# EAGLE board Hive_Max_Masse_neu4a (EAGLE 6.3), part 1 of 3
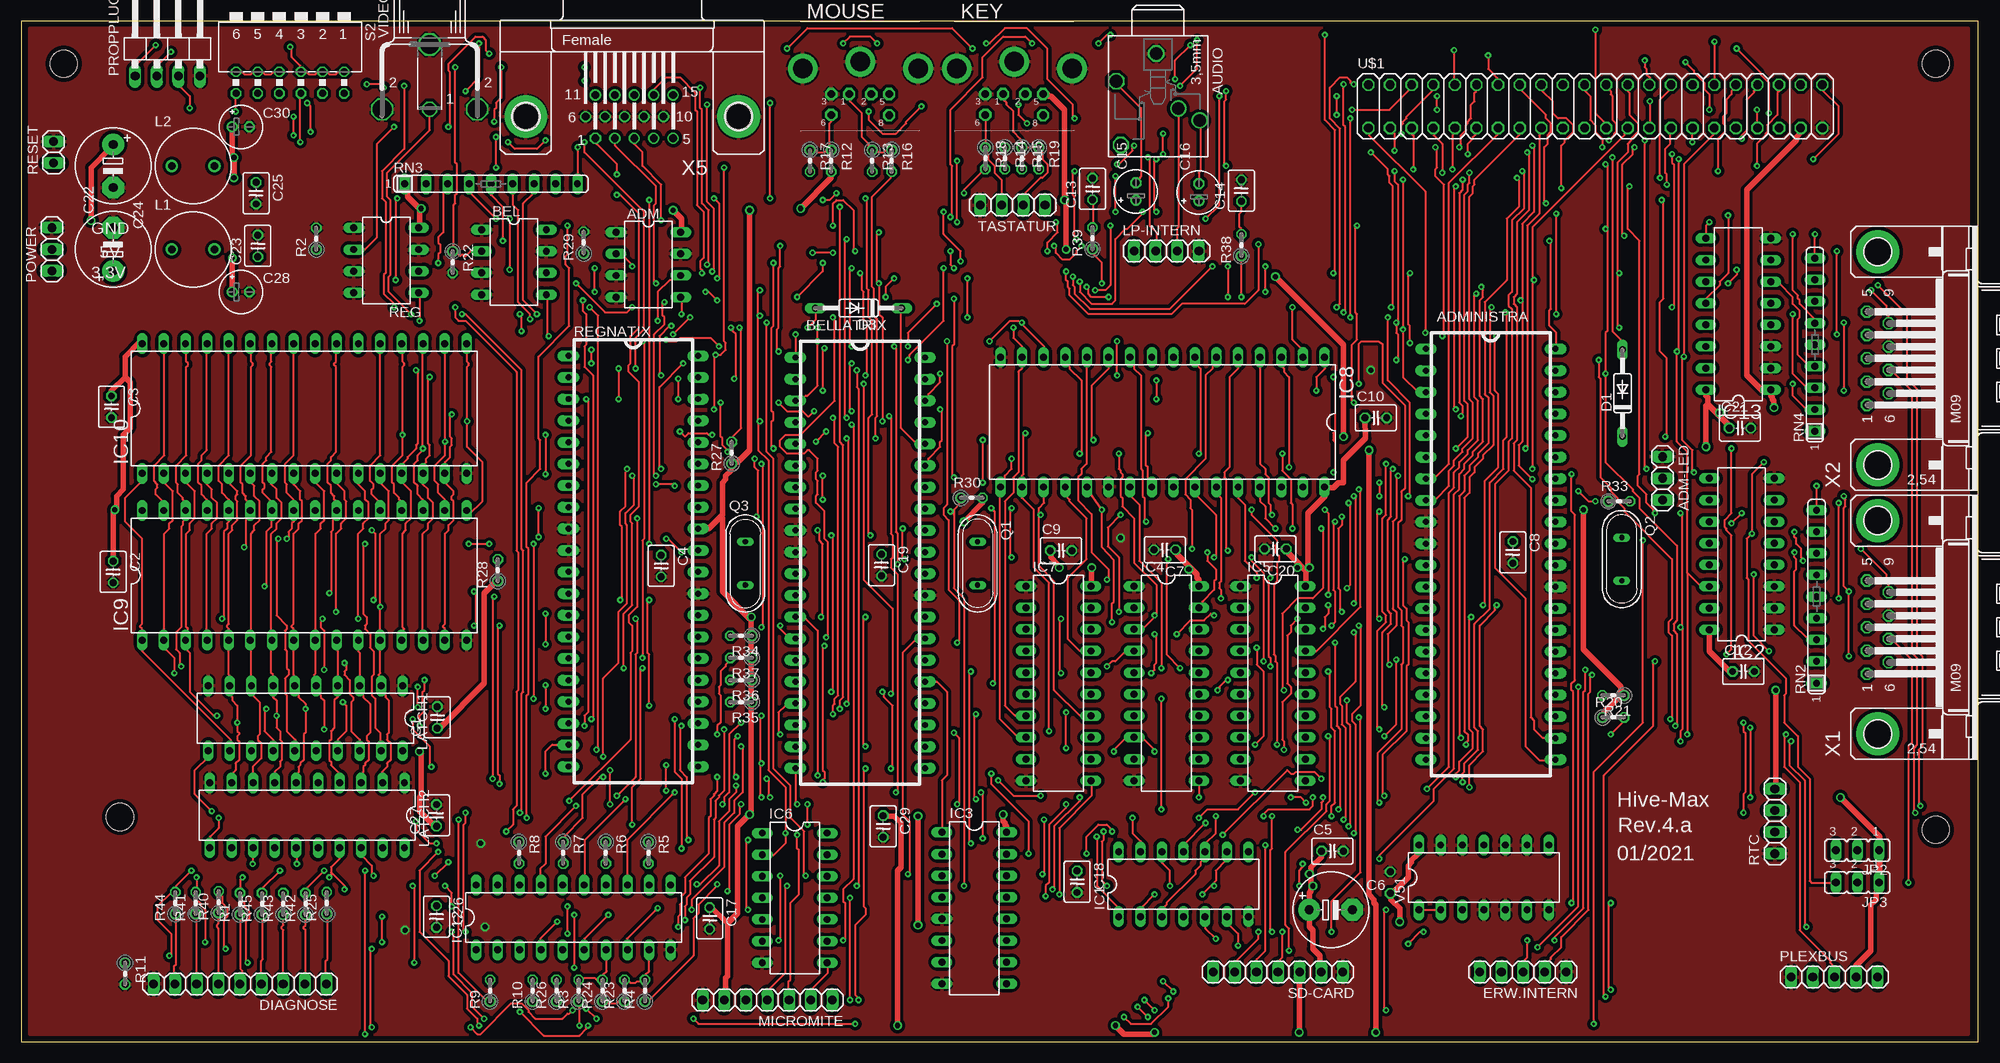
[diagram p5: board, top side]
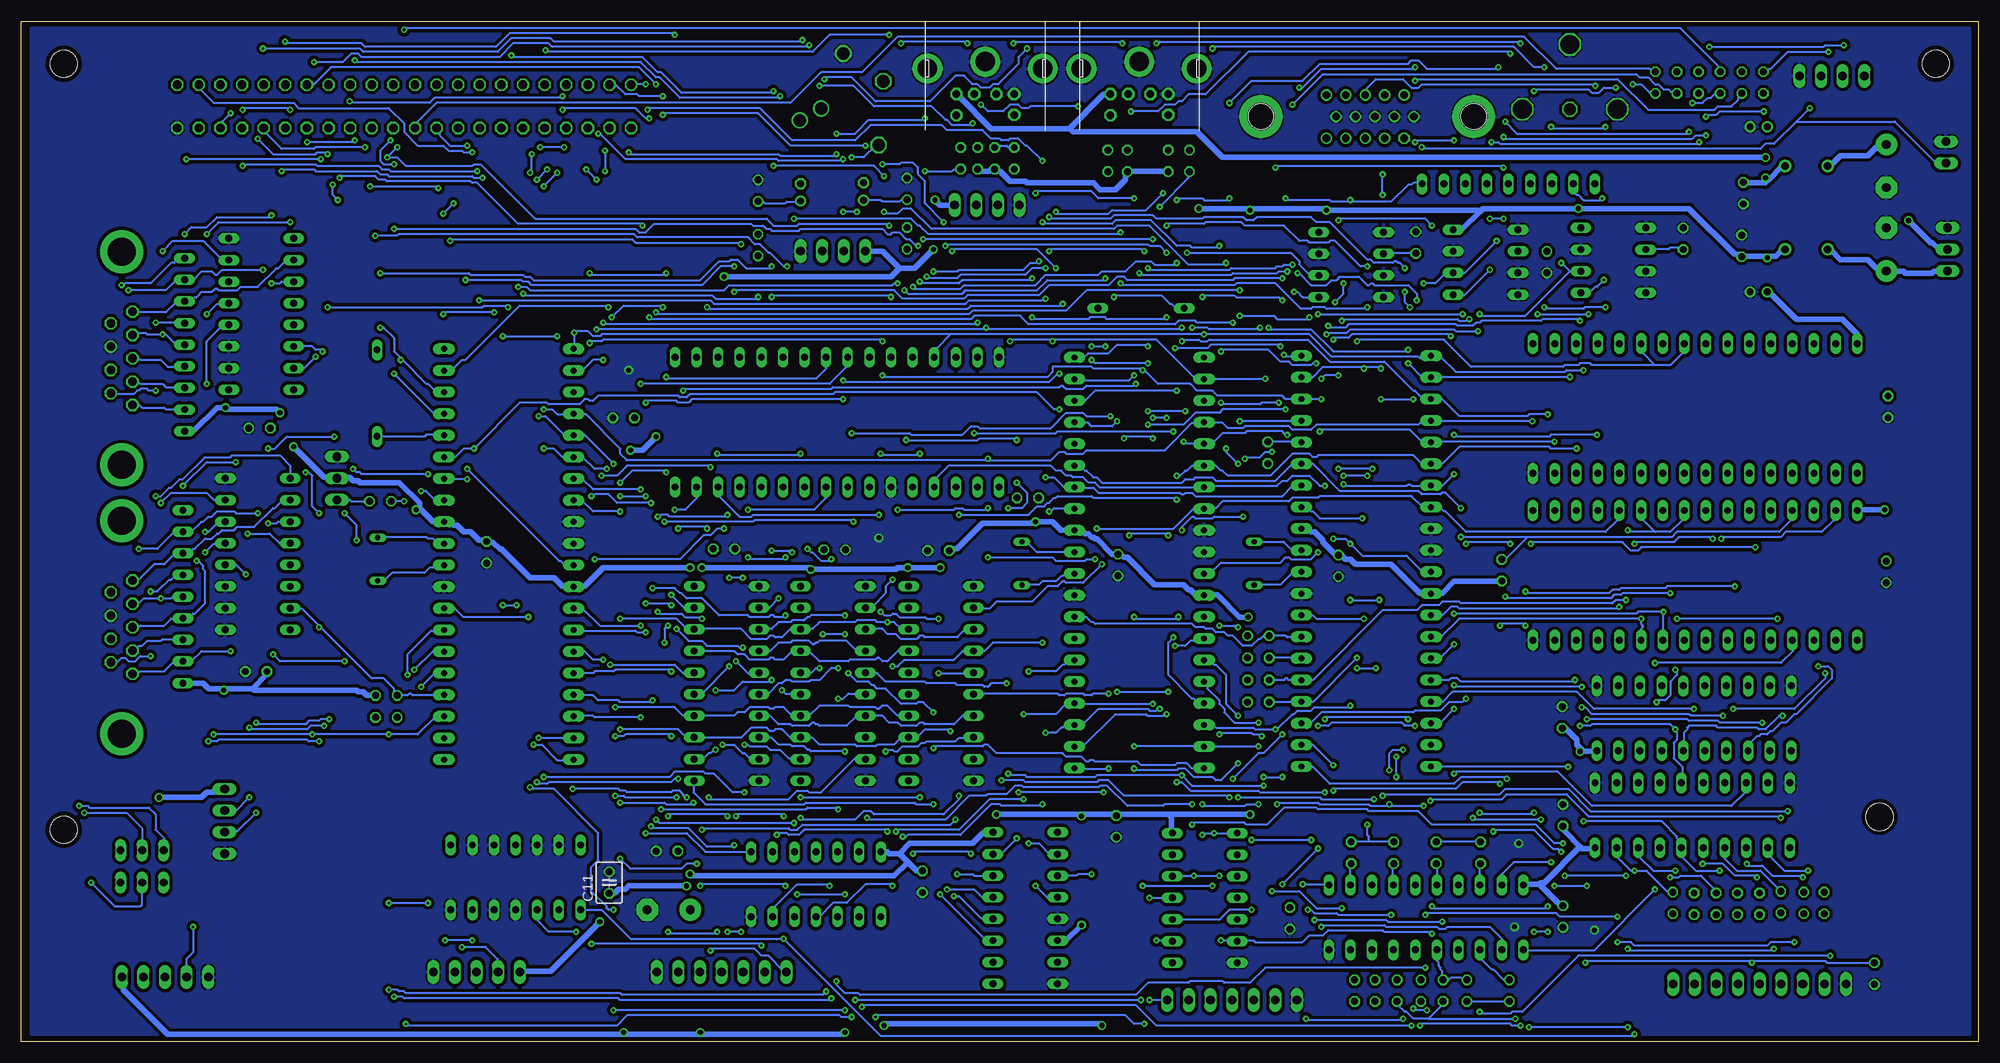
[diagram p6: board, bottom side, seen from below]

Size 230 x 119.9 mm. Coordinates in mm from the lower left corner, seen from the top.
Outline: 0,0 230,0 230,119.9 0,119.9 0,0
Copper layers (1*16): Top 0.035mm / dielectric 1.5mm / Bottom 0.035mm
Design rules "PCB-POOL": minimum track width 6mil, minimum drill 12mil, track to track 6mil, track to pad 6mil, pad to pad 6mil, via to via 6mil, smd to smd 6mil, copper to edge 20mil, drill to drill 8mil, minimum pad ring 8mil, minimum via ring 8mil, stop-mask expansion 3mil, vias tented up to drill 24mil, thermal gap 8mil
Net classes: 0 default: width 0.254 mm, clearance 0.254 mm; 1 Power: width 0.635 mm, drill 0.61 mm, clearance 0.381 mm; 2 AudioVideo: width 0.254 mm, clearance 0.254 mm; 3 Priority: width 0.279 mm, clearance 0.279 mm
Holes 3.2 mm at 5,114.9 11.6,26.4 225,24.9 225,114.9

## Footprints (pad centres in the part's own frame; a part is rotated, then mirrored left to right if it is on the bottom)
DIL08 = drill 0.813 long: 1 -3.81,-3.81; 2 -1.27,-3.81; 3 1.27,-3.81; 4 3.81,-3.81; 5 3.81,3.81; 6 1.27,3.81; 7 -1.27,3.81; 8 -3.81,3.81
1X03 = drill 1.016 long: 1 -2.54,0; 2 0,0; 3 2.54,0
P8X32A-D40 = drill 0.7 pad 1.27 long: 1 -7.62,23.495; 2 -7.62,20.955; 3 -7.62,18.415; 4 -7.62,15.875; 5 -7.62,13.335; 6 -7.62,10.795; 7 -7.62,8.255; 8 -7.62,5.715; 9 -7.62,3.175; 10 -7.62,0.635; 11 -7.62,-1.905; 12 -7.62,-4.445; 13 -7.62,-6.985; 14 -7.62,-9.525; 15 -7.62,-12.065; 16 -7.62,-14.605; 17 -7.62,-17.145; 18 -7.62,-19.685; 19 -7.62,-22.225; 20 -7.62,-24.765; 21 7.62,-24.765; 22 7.62,-22.225; 23 7.62,-19.685; 24 7.62,-17.145; 25 7.62,-14.605; 26 7.62,-12.065; 27 7.62,-9.525; 28 7.62,-6.985; 29 7.62,-4.445; 30 7.62,-1.905; 31 7.62,0.635; 32 7.62,3.175; 33 7.62,5.715; 34 7.62,8.255; 35 7.62,10.795; 36 7.62,13.335; 37 7.62,15.875; 38 7.62,18.415; 39 7.62,20.955; 40 7.62,23.495
PG203J = drill 1.499 octagon: 1 -5.004,-0.203; 4 5.74,-4.369; 5 -1.753,-4.902 | drill 1.499: 2 2.845,4.902; 3 1.448,2.388
C025-030X050 = drill 0.813 octagon: 1 -1.27,0; 2 1.27,0
E5-8,5 = drill 1.016 pad 2.54: + -2.54,0 | drill 1.016 pad 2.54 octagon: - 2.54,0
E2-5 = drill 0.813 pad 1.27: + -1.016,0 | drill 0.813 pad 1.27 octagon: - 1.016,0
DO35-10 = drill 0.813 long: A 5.08,0; C -5.08,0
1X09 = drill 1.016 long: 1 -10.16,0; 2 -7.62,0; 3 -5.08,0; 4 -2.54,0; 5 0,0; 6 2.54,0; 7 5.08,0; 8 7.62,0; 9 10.16,0
1X05 = drill 1.016 long: 1 -5.08,0; 2 -2.54,0; 3 0,0; 4 2.54,0; 5 5.08,0
DIL14 = drill 0.813 long: 1 -7.62,-3.81; 2 -5.08,-3.81; 3 -2.54,-3.81; 4 0,-3.81; 5 2.54,-3.81; 6 5.08,-3.81; 7 7.62,-3.81; 8 7.62,3.81; 9 5.08,3.81; 10 2.54,3.81; 11 0,3.81; 12 -2.54,3.81; 13 -5.08,3.81; 14 -7.62,3.81
DIL16 = drill 0.813 long: 1 -8.89,-3.81; 2 -6.35,-3.81; 3 -3.81,-3.81; 4 -1.27,-3.81; 5 1.27,-3.81; 6 3.81,-3.81; 7 6.35,-3.81; 8 8.89,-3.81; 9 8.89,3.81; 10 6.35,3.81; 11 3.81,3.81; 12 1.27,3.81; 13 -1.27,3.81; 14 -3.81,3.81; 15 -6.35,3.81; 16 -8.89,3.81
DIL20 = drill 0.813 long: 1 -11.43,-3.81; 2 -8.89,-3.81; 3 -6.35,-3.81; 4 -3.81,-3.81; 5 -1.27,-3.81; 6 1.27,-3.81; 7 3.81,-3.81; 8 6.35,-3.81; 9 8.89,-3.81; 10 11.43,-3.81; 11 11.43,3.81; 12 8.89,3.81; 13 6.35,3.81; 14 3.81,3.81; 15 1.27,3.81; 16 -1.27,3.81; 17 -3.81,3.81; 18 -6.35,3.81; 19 -8.89,3.81; 20 -11.43,3.81
DIL32 = drill 0.813 long: 1 -17.78,-7.62; 2 -15.24,-7.62; 3 -12.7,-7.62; 4 -10.16,-7.62; 5 -7.62,-7.62; 6 -5.08,-7.62; 7 -2.54,-7.62; 8 0,-7.62; 9 2.54,-7.62; 10 5.08,-7.62; 11 7.62,-7.62; 12 10.16,-7.62; 13 12.7,-7.62; 14 15.24,-7.62; 15 17.78,-7.62; 16 20.32,-7.62; 17 20.32,7.62; 18 17.78,7.62; 19 15.24,7.62; 20 12.7,7.62; 21 10.16,7.62; 22 7.62,7.62; 23 5.08,7.62; 24 2.54,7.62; 25 0,7.62; 26 -2.54,7.62; 27 -5.08,7.62; 28 -7.62,7.62; 29 -10.16,7.62; 30 -12.7,7.62; 31 -15.24,7.62; 32 -17.78,7.62
JP2 = drill 0.914 long: 1 -2.54,0; 2 0,0; 3 2.54,0
M_DIN6 = drill 0.9 pad 1.422 octagon: 1 -1.3,-3.75; 2 1.3,-3.75; 3 -3.4,-3.75; 5 3.4,-3.75; 6 -3.4,-6.2; 8 3.4,-6.25 | drill 2.3 pad 3.5: SH1 6.8,-0.75; SH2 0,0.05; SH3 -6.75,-0.75
6000-XXXX-RC = drill 0.9 pad 1.422: 1 -2.5,0; 2 2.5,0
1X04 = drill 1.016 long: 1 -3.81,0; 2 -1.27,0; 3 1.27,0; 4 3.81,0
1X07 = drill 1.016 long: 1 -7.62,0; 2 -5.08,0; 3 -2.54,0; 4 0,0; 5 2.54,0; 6 5.08,0; 7 7.62,0
1X04/90 = drill 1.016 long: 1 -3.81,-3.81; 2 -1.27,-3.81; 3 1.27,-3.81; 4 3.81,-3.81
QS = drill 0.61 long: 1 -2.54,0; 2 2.54,0
0204V = drill 0.813 octagon: 1 -1.27,0; 2 1.27,0
1X02 = drill 1.016 long: 1 -1.27,0; 2 1.27,0
SIL9 = drill 0.813 long: 1 -10.16,0; 2 -7.62,0; 3 -5.08,0; 4 -2.54,0; 5 0,0; 6 2.54,0; 7 5.08,0; 8 7.62,0; 9 10.16,0
DA-06 = drill 0.813 octagon: 1 -6.35,-1.27; 2 -3.81,-1.27; 3 -1.27,-1.27; 4 1.27,-1.27; 5 3.81,-1.27; 6 6.35,-1.27; 7 6.35,1.27; 8 3.81,1.27; 9 1.27,1.27; 10 -1.27,1.27; 11 -3.81,1.27; 12 -6.35,1.27
2X22-COMMODORE = drill 1.016 octagon: 1 -26.67,-2.54; 2 -26.67,2.54; 3 -24.13,-2.54; 4 -24.13,2.54; 5 -21.59,-2.54; 6 -21.59,2.54; 7 -19.05,-2.54; 8 -19.05,2.54; 9 -16.51,-2.54; 10 -16.51,2.54; 11 -13.97,-2.54; 12 -13.97,2.54; 13 -11.43,-2.54; 14 -11.43,2.54; 15 -8.89,-2.54; 16 -8.89,2.54; 17 -6.35,-2.54; 18 -6.35,2.54; 19 -3.81,-2.54; 20 -3.81,2.54; 21 -1.27,-2.54; 22 -1.27,2.54; 23 1.27,-2.54; 24 1.27,2.54; 25 3.81,-2.54; 26 3.81,2.54; 27 6.35,-2.54; 28 6.35,2.54; 29 8.89,-2.54; 30 8.89,2.54; 31 11.43,-2.54; 32 11.43,2.54; 33 13.97,-2.54; 34 13.97,2.54; 35 16.51,-2.54; 36 16.51,2.54; 37 19.05,-2.54; 38 19.05,2.54; 39 21.59,-2.54; 40 21.59,2.54; 41 24.13,-2.54; 42 24.13,2.54; 43 26.67,-2.54; 44 26.67,2.54
TOBU3 = drill 1.397 octagon: 1 0,-2.54 | drill 2.21 octagon: 2 5.588,-2.54; 2@1 -5.588,-2.54; 2@2 0,5.08
M09HP = drill 1.016 octagon: 1 -5.486,1.27; 2 -2.743,1.27; 3 0,1.27; 4 2.743,1.27; 5 5.486,1.27; 6 -4.115,-1.27; 7 -1.372,-1.27; 8 1.372,-1.27; 9 4.115,-1.27 | drill 3.302 pad 5.08: G1 -12.522,0; G2 12.522,0
HDF15H = drill 0.9 octagon: 1 4.329,2.54 | drill 0.9: 2 2.043,2.54; 3 -0.243,2.54; 4 -2.529,2.54; 5 -4.815,2.54; 6 5.472,0; 7 3.186,0; 8 0.9,0; 9 -1.386,0; 10 -3.672,0; 11 4.329,-2.54; 12 2.043,-2.54; 13 -0.243,-2.54; 14 -2.529,-2.54; 15 -4.815,-2.54 | drill 3.2 pad 5: VSS -12.5,0; VSS1 12.5,0 | hole 3: -12.5,0; 12.5,0

## Placement (x,y rotation side)
ADM  Atmel 24C256  [DIL08]  73.7,91.3 270 top
ADM-LED  [1X03]  192.9,66.2 270 top
ADMINISTRA  P8X32A-D40  [P8X32A-D40]  172.7,57.9 0 top
AUDIO  PG203J  [PG203J]  133.6,111.1 270 top
BEL  Atmel 24C256  [DIL08]  57.9,91.6 270 top
BELLATRIX  P8X32A-D40  [P8X32A-D40]  98.6,56.9 0 top
C1  100nF  [C025-030X050]  48.9,38.1 90 top
C2  100nF  [C025-030X050]  10.8,55.2 270 top
C3  100nF  [C025-030X050]  10.6,74.6 270 top
C4  100nF  [C025-030X050]  75.2,55.9 270 top
C5  100nF  [C025-030X050]  154.1,22.4 0 top
C6  220µ  [E5-8,5]  153.9,15.5 0 top
C7  100nF  [C025-030X050]  134.4,57.8 180 top
C8  100nF  [C025-030X050]  175.3,57.5 270 top
C9  100nF  [C025-030X050]  122.2,57.7 0 top
C10  100nF  [C025-030X050]  159.2,73.3 0 top
C11  100nF  [C025-030X050]  160.9,18.7 90 bottom
C12  100nF  [C025-030X050]  202.4,43.5 0 top
C13  4,7nF  [C025-030X050]  125.9,100.2 90 top
C14  4,7nF  [C025-030X050]  143.4,100 90 top
C15  22µF  [E2-5]  131,99.9 90 top
C16  22µF  [E2-5]  138.4,99.8 90 top
C17  100nF  [C025-030X050]  80.9,14.5 270 top
C18  100nF  [C025-030X050]  124.1,18.8 270 top
C19  100nF  [C025-030X050]  101.1,56 270 top
C20  100nF  [C025-030X050]  147.4,57.9 180 top
C21  100nF  [C025-030X050]  202,72.1 0 top
C22  470µ  [E5-8,5]  10.8,93.1 90 top
C23  100nF  [C025-030X050]  27.8,93.5 90 top
C24  470µ  [E5-8,5]  10.8,102.9 270 top
C25  100nF  [C025-030X050]  27.6,99.7 270 top
C26  100nF  [C025-030X050]  48.8,14.7 270 top
C27  100nF  [C025-030X050]  48.8,26.6 90 top
C28  22µ  [E2-5]  25.8,88.1 0 top
C29  100nF  [C025-030X050]  101.3,25.3 270 top
C30  22µ  [E2-5]  25.8,107.5 0 top
D1  1N4446  [DO35-10]  188.2,76.2 90 top
D3  1N4446  [DO35-10]  98.4,86.2 180 top
DIAGNOSE  [1X09]  25.7,6.8 180 top
ERW.INTERN  [1X05]  176.5,8.2 180 top
IC1  4066N  [DIL14]  136.6,18.5 0 top
IC2  PCF8574P  [DIL16]  202.2,57.3 90 top
IC3  74HC138N  [DIL16]  112,15.7 270 top
IC4  74HC374N  [DIL20]  134.6,42.1 270 top
IC5  74HC374N  [DIL20]  147.1,42.1 270 top
IC6  4066N  [DIL14]  90.9,16.9 270 top
IC7  74HC374N  [DIL20]  121.9,42.1 270 top
IC8  HM628512A_DIL32  [DIL32]  135.4,72.8 180 top
IC9  HM628512A_DIL32  [DIL32]  32,54.8 0 top
IC10  HM628512A_DIL32  [DIL32]  32,74.4 0 top
IC12  74HC244N  [DIL20]  64.9,14.6 0 top
IC13  PCF8574P  [DIL16]  201.8,85.5 90 top
JP2  [JP2]  215.8,22.5 180 top
JP3  [JP2]  215.8,18.7 180 top
KEY  [M_DIN6]  116.7,115.1 0 top
L1  330µH/1A  [6000-XXXX-RC]  20.2,93.1 0 top
L2  330µH/1A  [6000-XXXX-RC]  20.2,102.9 0 top
LATCH1  74HC573N  [DIL20]  33.4,38 180 top
LATCH2  74HC573N  [DIL20]  33.6,26.6 180 top
LP-INTERN  [1X04]  134.6,92.9 0 top
MICROMITE  [1X07]  87.7,4.9 180 top
MOUSE  [M_DIN6]  98.6,115.1 0 top
PLEXBUS  [1X05]  213.1,7.6 0 top
POWER  [1X03]  3.6,93.1 90 top
PROPPLUG  [1X04/90]  17.2,117.3 0 top
Q1  5 MHz  [QS]  112.4,56.2 270 top
Q2  5 MHz  [QS]  188.1,56.7 270 top
Q3  5 MHz  [QS]  85.1,56.2 90 top
R1  470  [0204V]  25.7,16.2 90 top
R2  10 kOhm  [0204V]  34.67,94.35 90 top
R3  240  [0204V]  65.5,6 90 top
R4  240  [0204V]  73.3,6 90 top
R5  240  [0204V]  73.7,22.2 270 top
R6  470  [0204V]  68.7,22.2 270 top
R7  240  [0204V]  63.7,22.2 270 top
R8  470  [0204V]  58.5,22.2 270 top
R9  240  [0204V]  55.1,6 90 top
R10  470  [0204V]  60.1,6 90 top
R11  10 kOhm  [0204V]  12.2,8 270 top
R12  10 KOhm  [0204V]  95.2,103.5 270 top
R13  10 KOhm  [0204V]  100,103.5 270 top
R14  10 KOhm  [0204V]  115.6,103.8 270 top
R15  10 KOhm  [0204V]  117.6,103.8 270 top
R16  100  [0204V]  102.3,103.5 270 top
R17  100  [0204V]  92.7,103.5 270 top
R18  100  [0204V]  113.3,103.8 270 top
R19  100  [0204V]  119.6,103.8 270 top
R20  10 KOhm  [0204V]  187.1,38.1 0 top
R21  10 KOhm  [0204V]  187.1,40.7 180 top
R22  10 kOhm  [0204V]  50.7,91.6 270 top
R23  1,1k  [0204V]  70.9,6 90 top
R24  560  [0204V]  68.3,6 90 top
R25  470  [0204V]  35.9,16.3 90 top
R26  270  [0204V]  62.9,6 90 top
R27  10 kOhm  [0204V]  83.5,69.2 90 top
R28  10 kOhm  [0204V]  56,55.4 90 top
R29  10 kOhm  [0204V]  66.1,93.9 90 top
R30  10 KOhm  [0204V]  111.7,63.9 0 top
R33  470  [0204V]  187.8,63.5 0 top
R34  10 kOhm  [0204V]  84.6,47.7 180 top
R35  10 KOhm  [0204V]  84.6,39.9 180 top
R36  10 KOhm  [0204V]  84.6,42.5 180 top
R37  10 kOhm  [0204V]  84.6,45.1 180 top
R38  20k  [0204V]  143.4,93.6 90 top
R39  20k  [0204V]  125.9,94.4 90 top
R40  470  [0204V]  23.2,16.4 90 top
R41  470  [0204V]  20.5,16.3 90 top
R42  470  [0204V]  33.4,16.2 90 top
R43  470  [0204V]  30.8,16.2 90 top
R44  470  [0204V]  18.1,16.3 90 top
R45  470  [0204V]  28.3,16.2 90 top
REG  Atmel 24C256  [DIL08]  42.9,91.81 270 top
REGNATIX  P8X32A-D40  [P8X32A-D40]  71.94,57.1 0 top
RESET  [1X02]  3.8,104.5 90 top
RN2  10k  [SIL9]  211,52.3 90 top
RN3  10k  [SIL9]  55.2,100.8 0 top
RN4  10k  [SIL9]  210.8,81.9 90 top
RTC  [1X04]  206.1,25.9 90 top
S2  [DA-06]  31.6,112.7 180 top
SD-CARD  [1X07]  147.7,8.2 180 top
TASTATUR  [1X04]  116.5,98.3 180 top
U$1  2X22COMMODORE  [2X22-COMMODORE]  185,109.9 0 top
V51  74HC00N  [DIL14]  171.9,19.3 0 top
VIDEO  [TOBU3]  48,112.1 0 top
X1  [M09HP]  218.2,48.7 90 top
X2  [M09HP]  218.2,80.3 90 top
X5  [HDF15H]  71.8,108.7 180 top

## Tracks (layer width: path | path; a pad name or v marks a point on that pad's centre or on a via)
/HS  (via drill 0.3)
  Top 0.254: v92.4,83.9 93.4,84.9 93.4,86.1 D3.A | v84.4,83.9 84.6,83.7 84.6,72.1 83.6,71.1 83.6,70.5 R27.2 | D1.A 188.2,82.3 187,83.5 v187,103.9 | v185.8,105.1 185.8,106.1 185,106.9 185,107.7 184.4,108.3 184.4,111.1 183.8,111.7 183.8,112.3 U$1.22 | v101.6,87.5 101.6,88.7 v102.6,89.7 | v126.2,88.3 127.4,88.3 128,88.9 v128,95.9
  Bottom 0.254: R27.2 83.4,70.5 79.6,70.5 REGNATIX.36 | v92.4,83.9 90.6,83.9 90.4,83.7 84.6,83.7 v84.4,83.9 | v185.8,105.1 v187,103.9 185.8,103.9 184.8,102.9 177,102.9 176.8,103.1 176,103.1 169.6,96.7 142.4,96.7 141.6,95.9 138.8,95.9 138.6,96.1 128.2,96.1 v128,95.9 | v101.6,87.5 101.4,87.7 96,87.7 95,86.7 94.8,86.7 94.4,86.3 93.4,86.3 D3.A | v102.6,89.7 102.8,89.5 109.4,89.5 110.6,88.3 119,88.3 119.4,87.9 125.8,87.9 v126.2,88.3
A0  (via drill 0.3)
  Top 0.254: IC10.12 42.2,66.7 42.2,65.7 43.2,64.7 43.2,61.3 42.8,60.9 42.8,60.3 42.2,59.7 v42.2,51.1 42.2,47.3 IC9.12 42.2,47.1 42.2,43.3 42,43.1 42.2,42.9 42.2,41.9 LATCH1.2 42.2,41.7 42.2,41.3 42.8,40.7 42.8,40.5 43.2,40.1 43.2,36.3 43,36.1 43,35.5 43.4,35.1 43.4,33.1 43,32.7 43,32.3 42.4,31.7 42.4,30.5 LATCH2.2
  Bottom 0.254: v42.2,51.1 42.4,50.9 61,50.9 61.2,51.1 62,51.1 63,50.1 64.2,50.1 REGNATIX.13
A0..A7  (via drill 0.3)
  Top 0.254: v121.2,17.9 121.4,18.1 121.4,25.3 124.4,28.3 v124.4,28.7 | v138.4,28.7 138.4,30.5 IC4.11
  Bottom 0.254: v121.2,17.9 118,17.9 117,16.9 116,16.9 IC3.13 | v138.4,28.7 v124.4,28.7
A1  (via drill 0.3)
  Top 0.254: LATCH2.3 40,30.5 40,31.5 40.2,31.7 40.2,32.3 40.4,32.5 40.4,32.7 40.8,33.1 40.8,35.3 40.6,35.5 40.6,35.9 41,36.3 41,39.7 40.2,40.5 40.2,40.7 39.8,41.1 39.8,41.7 LATCH1.3 39.8,41.9 39.8,45.7 39.6,45.9 39.6,47.1 IC9.11 | v39.6,49.7 39.6,59.7 40.2,60.3 40.2,60.9 40.8,61.5 40.8,63.3 40.4,63.7 40.4,64.7 39.6,65.5 39.6,66.7 IC10.11
  Bottom 0.254: IC9.11 39.6,47.3 39.6,48.5 39.4,48.7 39.4,48.9 39.6,49.1 v39.6,49.7 61,49.7 63.2,47.5 64.2,47.5 REGNATIX.14
A2  (via drill 0.3)
  Top 0.254: LATCH2.4 37.4,30.5 37.4,31.5 36.4,32.5 36.4,32.9 36.2,33.1 36.2,35.3 36.4,35.5 36.4,36.5 36.8,36.9 36.8,40.1 37.2,40.5 37.2,41.7 LATCH1.4 37.2,41.9 37.2,45.9 37,46.1 37,47.1 IC9.10 | v37,50.5 37,59.7 37.6,60.3 37.6,60.9 38.2,61.5 38.2,63.5 38,63.7 38,64.7 37,65.7 37,66.7 IC10.10 | v61.6,50.3 v61.6,46.7
  Bottom 0.254: IC9.10 37,47.3 v37,50.5 40,50.5 40.2,50.3 v61.6,50.3 | v61.6,46.7 63.2,45.1 64.2,45.1 REGNATIX.15
A3  (via drill 0.3)
  Top 0.254: IC10.9 34.6,66.7 34.6,65.7 35.6,64.7 35.6,61.3 35.2,60.9 35.2,60.3 34.6,59.7 34.6,47.3 IC9.9 34.6,47.1 34.6,43.3 34.4,43.1 34.6,42.9 34.6,41.9 LATCH1.5 34.6,41.7 34.6,41.3 35.2,40.7 35.2,40.5 35.6,40.1 v35.6,36.7 | v47.4,42.5 47.4,41.3 47.2,41.1 47.2,39.9 47.4,39.7 47.4,38.9 46.8,38.3 v46.8,37.1
  Bottom 0.254: LATCH2.5 34.8,30.5 34.8,32.3 35.8,33.3 35.8,35.1 35.4,35.5 35.4,36.3 v35.6,36.7 36.2,37.3 45.4,37.3 45.6,37.1 v46.8,37.1 | v47.4,42.5 47.6,42.3 60.8,42.3 61.2,42.7 62,42.7 62.2,42.5 64.2,42.5 REGNATIX.16
A4  (via drill 0.3)
  Top 0.254: IC10.8 32,65.5 32.8,64.7 32.8,63.7 33,63.5 33,61.3 32.6,60.9 32.6,60.3 32,59.7 32,49.1 31.8,48.9 31.8,48.7 32,48.5 IC9.8 32,43.1 32.2,42.9 32.2,41.9 LATCH1.6 32.2,41.7 32.2,41.1 32.6,40.7 32.6,40.5 33.4,39.7 v33.4,39.1 33.4,36.3 33.2,36.1 33.2,33.1 32.8,32.7 32.8,32.5 32.6,32.3 32.6,31.7 32.4,31.5 32.4,30.5 LATCH2.6
  Bottom 0.254: v33.4,39.1 45.2,39.1 47.2,41.1 61.8,41.1 63,39.9 64.2,39.9 REGNATIX.17
A5  (via drill 0.3)
  Top 0.254: IC10.7 29.4,66.7 29.4,65.5 30,64.9 30,63.9 30.6,63.3 30.6,61.5 30,60.9 30,60.3 29.4,59.7 29.4,47.3 IC9.7 29.4,47.1 29.4,43.3 29.6,43.1 29.6,41.9 LATCH1.7 29.6,41.7 29.6,40.5 30,40.1 v30,38.3 30,36.9 30.4,36.5 30.4,35.5 30.6,35.3 30.6,33.1 30.4,32.9 30.4,32.3 29.8,31.7 29.8,30.5 LATCH2.7 | v61.6,41.9 v61.6,39.1 | v46.6,39.3 v46.6,41.7
  Bottom 0.254: v61.6,39.1 63.2,37.5 64.2,37.5 REGNATIX.18 | v61.6,41.9 61.4,41.7 v46.6,41.7 | v46.6,39.3 46.2,39.3 45.4,38.5 34,38.5 33.8,38.3 v30,38.3
A6  (via drill 0.3)
  Top 0.254: IC10.6 27,66.7 27,65.7 27.4,65.3 27.4,64.1 28,63.5 28,61.3 27.4,60.7 27.4,60.1 27,59.7 27,47.3 IC9.6 27,47.1 27,41.9 LATCH1.8 27,41.7 27,40.9 28,39.9 28,36.1 27.8,35.9 27.8,35.5 28.2,35.1 28.2,33.3 27.2,32.3 27.2,30.5 LATCH2.8 | v61.6,31.5 61.6,34.1 62.4,34.9 64.2,34.9 REGNATIX.19
  Bottom 0.254: v61.6,31.5 61.4,31.7 49.4,31.7 45.4,27.7 29,27.7 27.4,29.3 27.4,30.3 LATCH2.8
A7  (via drill 0.3)
  Top 0.254: IC10.5 24.4,66.7 24.4,65.7 25.4,64.7 25.4,64.3 25.2,64.1 25.2,63.7 25.4,63.5 25.4,61.3 24.8,60.7 24.8,60.1 24.4,59.7 24.4,49.1 24.2,48.9 24.2,48.7 24.4,48.5 24.4,47.3 IC9.5 24.4,47.1 24.4,43.1 24.6,42.9 24.6,41.9 LATCH1.9 24.6,41.7 24.6,40.7 24.8,40.5 24.8,40.1 25.4,39.5 v25.4,37.5 25.4,36.5 25.6,36.3 25.6,36.1 25.4,35.9 25.4,35.5 25.6,35.3 25.6,33.1 25.2,32.7 25.2,31.9 24.8,31.5 24.8,30.5 LATCH2.9 | v48.2,32.3 48,32.5 48,34.7 46,36.7 v46,37.9
  Bottom 0.254: v48.2,32.3 64.2,32.3 REGNATIX.20 | v46,37.9 34.2,37.9 34,37.7 30.6,37.7 30.4,37.5 v25.4,37.5
A8  (via drill 0.3)
  Top 0.254: IC10.23 37,81.9 37,79.9 36.8,79.7 36.8,79.5 37,79.3 37,69.3 36.4,68.7 36.4,68.3 36,67.9 36,65.7 36.4,65.3 36.4,64.5 36.8,64.1 36.8,63.7 37,63.5 37,62.5 IC9.23 37,62.3 37,61.7 36.6,61.3 36.6,60.1 36.4,59.9 36.4,52.9 v36.2,52.7 | v55.4,30.9 55.4,52.1 v55.6,52.3
  Bottom 0.254: v55.4,30.9 55.6,31.1 60.8,31.1 61.6,30.3 76.2,30.3 78.2,32.3 79.4,32.3 REGNATIX.21 | v55.6,52.3 55.4,52.1 43.2,52.1 42.8,52.5 42,52.5 41.8,52.7 v36.2,52.7
A8..A15  (via drill 0.3)
  Top 0.254: v120.4,17.1 120.4,18.3 120.8,18.7 120.8,25.5 122.8,27.5 v122.8,27.9
  Bottom 0.254: v120.4,17.1 119.8,17.1 117.2,14.5 116,14.5 IC3.12 | v122.8,27.9 124.8,27.9 125,28.1 137.8,28.1 138,27.9 149.6,27.9 151,29.3 151,30.5 IC5.11
A9  (via drill 0.3)
  Top 0.254: IC10.26 29.4,81.9 29.4,79.9 29.2,79.7 29.2,79.5 29.4,79.3 29.4,69.3 28.8,68.7 28.8,68.3 28.4,67.9 28.4,65.7 28.6,65.5 28.6,65.1 28.4,64.9 28.4,64.5 29.4,63.5 29.4,62.5 IC9.26 29.4,62.3 29.4,60.5 28.8,59.9 28.8,53.7 v28.6,53.5 | v75.8,29.5 v75.8,32.5 | v56.2,30.3 56.2,31.3 56,31.5 56,48.7 v56.2,48.9 | v53.2,48.9 53.4,49.1 53.4,52.7 v53.2,52.9
  Bottom 0.254: v75.8,32.5 78.2,34.9 79.4,34.9 REGNATIX.22 | v75.8,29.5 75.6,29.7 61.4,29.7 60.6,30.5 56.4,30.5 v56.2,30.3 | v56.2,48.9 56,49.1 53.4,49.1 v53.2,48.9 | v53.2,52.9 53,52.7 43.4,52.7 43,53.1 42.2,53.1 42,53.3 36.8,53.3 36.6,53.5 v28.6,53.5
A10  (via drill 0.3)
  Top 0.254: IC10.27 27,81.9 27,79.9 27.2,79.7 27.2,79.5 27,79.3 27,68.9 25.8,67.7 25.8,65.7 26,65.5 26,64.5 26.4,64.1 26.4,63.7 27,63.1 27,62.5 IC9.27 27,62.3 27,61.9 26.4,61.3 26.4,58.3 v26.2,58.1 | v60.2,58.5 v60.2,40.3 | v52.6,58.5 v55,58.5
  Bottom 0.254: v60.2,40.3 60.6,39.9 62.2,39.9 63.2,38.9 66.2,38.9 66.4,38.7 77.2,38.7 78.4,37.5 79.4,37.5 REGNATIX.23 | v60.2,58.5 60,58.7 55.2,58.7 v55,58.5 | v52.6,58.5 52.4,58.7 41.8,58.7 40.8,57.7 40,57.7 39.6,58.1 v26.2,58.1
A16..A18  (via drill 0.3)
  Top 0.254: v122,17.3 122,25.1 125.8,28.9 125.8,30.5 IC7.11
  Bottom 0.254: v122,17.3 116.6,11.9 116,11.9 IC3.11
ADM14  (via drill 0.3)
  Top 0.254: v169.2,35.7 169,35.9 169,64.1 169.6,64.7 169.6,66.5 170.2,67.1 170.2,67.7 171.2,68.7 171.2,69.1 172.4,70.3 172.4,75.7 172,76.1 172,86.9 174.6,89.5 174.6,96.7 176,98.1 176,101.3 v175.8,101.5 | v199.4,102.3 199.4,106.1 200.2,106.9 200.2,107.7 200,107.9 200,108.7 200.4,109.1 200.4,110.7 201,111.3 201,111.7 201.4,112.1 201.6,112.1 201.6,112.3 U$1.36
  Bottom 0.254: v169.2,35.7 165.2,35.7 ADMINISTRA.19 | v175.8,101.5 176.8,101.5 177,101.7 186.8,101.7 187,101.9 187.8,101.9 188.2,102.3 195.4,102.3 195.6,102.5 199.2,102.5 v199.4,102.3
ADM15  (via drill 0.3)
  Top 0.254: v169.8,34.9 169.8,35.1 170,35.3 170,36.1 169.6,36.5 169.6,63.9 170.2,64.5 170.2,66.3 170.8,66.9 170.8,67.5 171.8,68.5 171.8,68.9 173,70.1 173,75.9 172.6,76.3 172.6,86.1 v172.8,86.3 | v194,86.3 194.2,86.5 194.2,103.1 194,103.3 v194,104.3 | v202.2,106.1 202.2,106.5 202.8,107.1 202.8,110.7 203.6,111.5 203.6,111.7 204,112.1 204,112.3 U$1.38
  Bottom 0.254: v169.8,34.9 168.8,34.9 167,33.1 165.2,33.1 ADMINISTRA.20 | v172.8,86.3 173,86.5 175.6,86.5 175.8,86.3 v194,86.3 | v194,104.3 194.2,104.3 194.4,104.5 195.2,104.5 195.4,104.3 200.4,104.3 v202.2,106.1
ADM16  (via drill 0.3)
  Top 0.254: v176.4,102.3 176.6,102.1 176.6,97.9 175.2,96.5 175.2,88.1 174.8,87.7 174.8,86.5 175.2,86.1 175.2,70.9 174.8,70.5 174.8,67.1 173.2,65.5 173.2,55.7 176.8,52.1 176.8,34.7 178.4,33.1 180.2,33.1 ADMINISTRA.21 | v204,102.9 204,105.5 205,106.5 205,106.7 205.2,106.9 205.2,107.7 206.4,108.9 206.4,111.5 206.6,111.7 206.6,112.3 U$1.40
  Bottom 0.254: v176.4,102.3 186.6,102.3 186.8,102.5 187.6,102.5 188,102.9 195.2,102.9 195.4,103.1 203.8,103.1 v204,102.9
ADM17  (via drill 0.3)
  Top 0.254: v177,104.5 177.2,104.3 177.2,97.7 175.8,96.3 175.8,87.9 175.4,87.5 175.4,86.7 175.8,86.3 175.8,70.7 175.4,70.3 175.4,67.1 177.4,65.1 177.4,38.1 177.8,37.7 177.8,36.7 178.8,35.7 180.2,35.7 ADMINISTRA.22
  Bottom 0.254: v177,104.5 178,104.5 178.2,104.7 179.8,104.7 180.4,105.3 183.4,105.3 185,106.9 185,107.9 186.8,109.7 197.4,109.7 198,110.3 207.4,110.3 209.4,112.3 209.4,112.5 209.2,112.5 U$1.42
ADM18  (via drill 0.3)
  Top 0.254: v186.8,36.1 188.2,37.5 188.2,38.1 R20.2 | v207.4,36.1 207.2,35.9 207.2,32.3 209,30.5 209,13.1 212.6,9.5 212.6,9.3 213.2,8.7 213.2,7.7 PLEXBUS.3 | 195.8,55.1 195.8,69.3 194.6,70.5 v194.6,81.1 194.8,81.3 v194.8,103.7 | 195.8,55.1 197.2,53.7 198.4,53.7 IC2.14 | v210.6,103.7 213.6,106.7 213.6,109.9 211.8,111.7 211.8,112.3 U$1.44 | 195.8,55.1 v195.8,36.1
  Bottom 0.254: ADMINISTRA.23 180.4,38.3 181.2,38.3 183.4,36.1 v186.8,36.1 v195.8,36.1 v207.4,36.1 | v194.6,81.1 194.8,81.3 195.4,81.3 195.8,81.7 197.8,81.7 IC13.14 | v194.8,103.7 v210.6,103.7
ADM19  (via drill 0.3)
  Top 0.254: U$1.33 199,107.3 199,106.7 195.4,103.1 v195.4,80.5 195.2,80.3 195.2,70.7 196.4,69.5 196.4,67.1 v196.6,66.9 | v209.8,13.5 209.6,13.7 209.6,30.7 207.8,32.5 207.8,35.1 v208,35.3 | v195,35.3 195,36.5 195.2,36.7 195.2,48.5 | v195,62.1 195.2,61.9 195.2,48.5 | 195.2,48.5 v195,48.7
  Bottom 0.254: v195.4,80.5 196.8,79.1 197.8,79.1 IC13.15 | ADMINISTRA.24 180.4,40.7 184,40.7 184.2,40.9 184.4,40.9 184.6,40.7 R21.2 186.2,40.7 186.2,41.5 187.4,42.7 188.8,42.7 194.8,48.7 | 194.8,48.7 197,50.9 198.2,50.9 IC2.15 | v209.8,13.5 209.8,10.5 210.6,9.7 210.6,7.7 PLEXBUS.2 | v208,35.3 207,35.3 206.8,35.5 196.4,35.5 196.2,35.3 v195,35.3 | 194.8,48.7 v195,48.7 | v196.6,66.9 196.2,66.9 195.8,66.5 195.8,62.9 v195,62.1
ADM20  (via drill 0.3)
  Top 0.254: v183,41.7 183,15.9 v178.2,11.1
  Bottom 0.254: v183,41.7 181.4,43.3 180.4,43.3 ADMINISTRA.25 | v178.2,11.1 175.4,11.1 174,9.7 174,8.3 ERW.INTERN.4
ADM21  (via drill 0.3)
  Top 0.254: v183.8,43.7 183.8,41.3 183.6,41.1 183.6,15.7 180.2,12.3 v180.2,11.9 | v177,11.9 177,9.9 176.6,9.5 176.6,8.3 ERW.INTERN.3
  Bottom 0.254: v183.8,43.7 181.6,45.9 180.4,45.9 ADMINISTRA.26 | v177,11.9 v180.2,11.9
ADM22  (via drill 0.3)
  Top 0.254: v184.6,43.1 184.4,42.9 184.4,41.1 184.2,40.9 184.2,15.5 181,12.3 181,11.1 179.8,9.9 179.8,9.7 179,8.9 179,8.3 ERW.INTERN.2
  Bottom 0.254: v184.6,43.1 184.6,45.5 181.8,48.3 180.4,48.3 ADMINISTRA.27
ADM-SCL  (via drill 0.3)
  Top 0.254: v59.8,84.9 59.8,85.5 58.4,86.9 58.4,97.7 57.8,98.3 57.8,100.7 RN3.6 | v74.8,84.7 74.8,88.1 76.2,89.5 76.4,89.5 76.6,89.7 77.6,89.7 77.6,89.9 ADM.6 | 186.4,95.5 186.4,102.9 v186.2,103.1 | 186.4,95.5 186.4,83.5 186.2,83.3 v186.2,78.5 186.2,68.1 189.4,64.9 189.4,64.7 190.2,63.9 190.2,62.7 194.6,58.3 194.6,49.5 194.2,49.1 194.2,48.3 194.6,47.9 194.6,37.3 v194.4,37.1 | v186.6,105.9 187.2,106.5 187.2,106.7 187.4,106.9 187.4,107.9 187,108.3 187,111.1 186.8,111.3 186.8,111.7 186.4,112.1 186.2,112.1 186.2,112.3 U$1.24 | v203.2,36.9 v203.2,28.7 | v95.4,92.7 v93,92.7 | v121.4,93.5 121.6,93.3 121.6,92.7 122.4,91.9 123.2,91.9 124,92.7 124,92.9 v124.6,93.5 | 186.4,95.5 v186.2,95.5
  Bottom 0.254: v59.8,84.9 60,84.9 60.2,84.7 61,84.7 61.2,84.9 74.6,84.9 v74.8,84.7 | v186.2,78.5 181.4,73.7 180.4,73.7 ADMINISTRA.37 | v186.2,103.1 187.4,103.1 187.8,103.5 187.8,104.7 v186.6,105.9 | v203.2,28.7 204.8,27.1 206,27.1 RTC.3 | v203.2,36.9 203,36.7 196.4,36.7 196,37.1 v194.4,37.1 | v93,92.7 80.8,92.7 79.8,91.7 79.8,91.3 78.6,90.1 77.6,90.1 ADM.6 | v95.4,92.7 96.2,93.5 97.4,93.5 97.6,93.7 121.2,93.7 v121.4,93.5 | v124.6,93.5 124.8,93.7 125,93.7 125.6,94.3 126,94.3 126.8,95.1 127.6,95.1 127.8,94.9 128.2,94.9 128.8,95.5 138.4,95.5 138.6,95.3 141.8,95.3 142,95.5 142.4,95.5 142.8,95.9 144,95.9 144.2,96.1 155.6,96.1 156.6,95.1 157.4,95.1 157.8,95.5 v186.2,95.5
ADM-SDA  (via drill 0.3)
  Top 0.254: v60.6,85.5 59,87.1 59,98.5 60.2,99.7 60.2,100.7 RN3.7 | v77.6,85.5 77.6,87.3 ADM.5 | v187.8,83.9 187.6,84.1 187.6,90.3 | 187.6,90.3 187.6,103.3 188.8,104.5 188.8,105.5 189.2,105.9 189.2,106.1 190,106.9 190,107.9 189,108.9 189,111.5 188.8,111.7 188.8,112.3 U$1.26 | v202.4,26.9 202.4,29.1 202.6,29.3 202.6,36.3 202.4,36.5 v202.4,37.5 | v193.8,37.9 194,38.1 194,47.7 193.6,48.1 193.6,49.3 194,49.7 194,56.7 188.4,62.3 188.4,62.7 187.6,63.5 187.6,63.9 186.8,64.7 186.8,65.1 185.6,66.3 185.6,77.9 185.4,78.1 v185.4,80.1 | v80.4,88.1 80.8,88.1 v81.8,87.1 | v91.2,87.5 94.2,90.5 v94.2,91.5 | v125.2,88.7 125.4,88.5 125.4,87.9 125.8,87.5 v127.8,87.5 | v141.8,91.1 v141.8,87.5 | 187.6,90.3 v187.8,90.3
  Bottom 0.254: v77.6,85.5 v60.6,85.5 | 185.2,80.1 186.2,81.1 186.2,82.7 187.4,83.9 v187.8,83.9 | 185.2,80.1 182.4,77.3 182.2,77.3 181.2,76.3 180.4,76.3 ADMINISTRA.38 | v202.4,26.9 204.6,24.7 206,24.7 RTC.2 | v202.4,37.5 202.2,37.3 196.6,37.3 196.2,37.7 195,37.7 194.8,37.9 v193.8,37.9 | 185.2,80.1 v185.4,80.1 | v80.4,88.1 80,88.1 79.4,87.5 77.6,87.5 ADM.5 | v81.8,87.1 82.2,87.5 87.2,87.5 87.4,87.7 91,87.7 v91.2,87.5 | v94.2,91.5 94.4,91.3 96.8,91.3 97.2,91.7 99,91.7 100.2,90.5 103,90.5 103.4,90.1 109.6,90.1 110.8,88.9 119.2,88.9 119.6,88.5 125,88.5 v125.2,88.7 | v127.8,87.5 128,87.7 141.6,87.7 v141.8,87.5 | v141.8,91.1 142,90.9 144.8,90.9 145.8,91.9 146.6,91.9 146.8,91.7 148,91.7 150.2,89.5 169.8,89.5 170.2,89.9 170.8,89.9 171,90.1 177.2,90.1 177.4,90.3 v187.8,90.3
B8  (via drill 0.3)
  Top 0.254: v79.4,18.5 79.8,18.5 82,20.7 82,25.9 83.2,27.1 83.2,28.5 84,29.3 v84,30.1 | v93.6,31.3 93.6,48.3 92.2,49.7 91,49.7 91,49.9 BELLATRIX.13 | v179.2,98.5 179,98.7 179,105.1 179.4,105.5 179.4,106.5 179.8,106.9 179.8,107.9 179.2,108.5 179.2,108.9 176.2,111.9 176.2,112.3 U$1.16 | v180.4,85.5 v180.4,97.3 | v174.4,85.7 174.6,85.5 174.6,71.1 174.2,70.7 174.2,67.3 172.6,65.7 172.6,50.9 170.8,49.1 170.8,36.9 171.2,36.5 171.2,34.3 169.6,32.7 169.6,31.7 169.4,31.5 v169.4,30.5 | v152.8,30.9 152,31.7 149.8,31.7 149.6,31.5 149.2,31.5 148.8,31.9 v141.2,24.3 | v128.2,24.7 128,24.9 128,25.1 127.6,25.5 126.6,25.5 125.2,24.1 v125.2,22.1 | v118.4,22.1 118.4,25.9 114,30.3 v114,31.5
  Bottom 0.254: v79.4,18.5 76.4,18.5 IC12.11 | v84,30.1 92.4,30.1 v93.6,31.3 103.6,31.3 103.8,31.1 111.8,31.1 112,31.3 113.8,31.3 v114,31.5 | v180.4,97.3 v179.2,98.5 | v180.4,85.5 180.2,85.7 v174.4,85.7 | v169.4,30.5 169.2,30.5 169,30.3 168.2,30.3 168,30.5 153.6,30.5 153.2,30.9 v152.8,30.9 | v141.2,24.3 141,24.5 140,24.5 139.8,24.3 138.6,24.3 138,24.9 128.4,24.9 v128.2,24.7 | v125.2,22.1 125,22.3 118.6,22.3 v118.4,22.1
B9  (via drill 0.3)
  Top 0.254: v76.8,29.3 71.2,23.7 71.2,18.5 IC12.13 | v94.2,30.5 94.2,30.7 94.4,30.9 94.4,31.7 94.2,31.9 94.2,46.3 v94.4,46.5 | v172.4,115.9 172.4,114.3 173.6,113.1 173.6,112.5 U$1.14 | v141.6,111.7 141.6,110.7 141.4,110.5 141.4,103.1 v141.6,102.9 | v128.6,97.5 v128.6,101.7 | v88.4,91.5 88.4,84.1 88.2,83.9 88.2,74.1 88.4,73.9 88.4,73.1 88.2,72.9 88.2,69.9 v88.4,69.7 | v87,67.9 87.2,67.7 87.2,48.9 v87,48.7 | v89.2,48.9 89.2,48.5 90,47.7 91,47.7 91,47.5 BELLATRIX.14
  Bottom 0.254: v76.8,29.3 84.4,29.3 84.6,29.5 92.6,29.5 93.6,30.5 v94.2,30.5 | v94.4,46.5 93.2,46.5 92.6,47.1 92.2,47.1 92,47.3 91,47.3 BELLATRIX.14 | v172.4,115.9 172.2,115.7 157,115.7 155.2,113.9 154.8,113.9 152.4,111.5 141.8,111.5 v141.6,111.7 | v141.6,102.9 129.8,102.9 v128.6,101.7 | v128.6,97.5 128.4,97.3 127,97.3 126.4,97.9 125.4,97.9 123,95.5 101.6,95.5 101.2,95.9 97.4,95.9 92.8,91.3 88.6,91.3 v88.4,91.5 | v88.4,69.7 88.4,69.3 v87,67.9 | v87,48.7 87.2,48.7 87.4,48.9 v89.2,48.9
B10  (via drill 0.3)
  Top 0.254: v71,28.5 66.2,23.7 66.2,18.5 IC12.15 | v87,28.7 86.8,28.9 86.8,32.7 | 86.8,32.7 86.8,38.1 v87,38.3 | v169,105.1 169,105.3 169.2,105.5 169.2,106.5 169.8,107.1 169.8,107.7 170,107.9 170,108.1 170.4,108.5 170.4,110.1 170.8,110.5 170.8,111.5 171,111.7 171,112.3 U$1.12 | v166.2,105.1 166.4,104.9 166.4,102.7 166.2,102.5 166.2,101.7 167.2,100.7 167.2,83.1 v167,82.9 | v173.4,82.9 173.2,82.7 173.2,76.5 173.6,76.1 173.6,67.5 172,65.9 172,51.5 v171.8,51.3 | v173.4,51.3 173.2,51.1 173.2,50.7 171.4,48.9 171.4,37.1 171.8,36.7 171.8,34.1 170.2,32.5 v170.2,29.9 | v160.4,15.5 160.2,15.3 160.2,3.9 v160.4,3.7 | v132,4.9 v133.2,3.7 | v98.4,4.9 98.2,5.1 98.2,5.3 98,5.5 98,13.7 99.2,14.9 99.2,15.7 99,15.9 99,31.9 v99.2,32.1 | 86.8,32.7 v87,32.7
  Bottom 0.254: v71,28.5 77.2,28.5 77.4,28.7 v87,28.7 | v87,38.3 88.4,39.7 88.4,43.1 89.6,44.3 89.8,44.3 90.4,44.9 90.8,44.9 BELLATRIX.15 | v166.2,105.1 v169,105.1 | v173.4,82.9 v167,82.9 | v173.4,51.3 v171.8,51.3 | v170.2,29.9 170,29.9 169.8,29.7 167.4,29.7 162.2,24.5 162.2,21.3 163,20.5 163,17.7 161.2,15.9 161.2,15.7 161,15.5 v160.4,15.5 | v133.2,3.7 v160.4,3.7 | v98.4,4.9 v132,4.9 | v99.2,32.1 99,31.9 94.2,31.9 94,32.1 93.2,32.1 92.2,31.1 90,31.1 89.6,30.7 89,30.7 v87,32.7
B11  (via drill 0.3)
  Top 0.254: v65.2,27.7 61.6,24.1 61.6,20.9 61,20.3 61,18.5 IC12.17 | v82.4,27.9 82.6,28.1 82.6,28.7 83.2,29.3 83.2,36.1 v84.6,37.5 | v168.4,116.5 168.4,112.5 U$1.10 | v128,118.3 127.6,118.3 v126.6,117.3 | v118.8,117.3 118,118.1 115.4,118.1 113,115.7 113,113.3 109.2,109.5 109.2,103.1 109.4,102.9 109.4,97.1 v109.2,96.9 | v67.4,88.1 v67.4,90.9 | v66.8,86.3 67.8,85.3 67.8,34.5 v67.6,34.3 | v69.2,27.9 v69.2,31.9
  Bottom 0.254: 69.2,27.7 71.4,27.7 71.6,27.9 77.4,27.9 77.6,28.1 82.2,28.1 v82.4,27.9 | 69.2,27.7 v65.2,27.7 | v84.6,37.5 87.4,37.5 88.6,38.7 88.6,39.1 89.2,39.7 89.2,40.1 90.6,41.5 90.6,42.3 90.8,42.3 BELLATRIX.16 | v168.4,116.5 168.2,116.3 137,116.3 135,118.3 v128,118.3 | v126.6,117.3 126.4,117.5 119,117.5 v118.8,117.3 | v109.2,96.9 109,96.7 102,96.7 101.6,97.1 97,97.1 96.6,96.7 91.2,96.7 91,96.9 86.4,96.9 86,96.5 85.2,96.5 84.8,96.9 78.4,96.9 77.8,96.3 76.2,96.3 71.8,91.9 71.4,91.9 71,91.5 68.8,91.5 68.6,91.7 68.4,91.7 68.2,91.5 68,91.5 v67.4,90.9 | v67.4,88.1 67.4,86.9 v66.8,86.3 | v67.6,34.3 68.8,34.3 69.2,33.9 v69.2,31.9 | 69.2,27.7 v69.2,27.9
B12  (via drill 0.3)
  Top 0.254: v77.2,13.5 77.2,14.7 77.4,14.9 77.4,16.1 77.6,16.3 77.6,17.1 78,17.5 78,19.3 80.8,22.1 80.8,26.3 81,26.5 81,28.5 81.4,28.9 81.4,29.1 81.8,29.5 v81.8,31.1 | v84,31.1 83.8,31.3 83.8,35.5 v84.2,35.9 | v89.2,36.1 89,36.3 89,38.7 89.8,39.5 91,39.5 91,39.7 BELLATRIX.17 | v162.2,106.7 162.2,107.7 162.4,107.9 162.4,108.1 162.8,108.5 162.8,108.7 165.8,111.7 165.8,112.3 U$1.8 | v133.4,103.7 133.2,103.5 133.2,97.7 v133.4,97.5 | v131.8,97.5 131.8,97.3 130,95.5 129.8,95.5 128.6,94.3 128.6,87.1 128.2,86.7 125.8,86.7 124.4,88.1 v124.4,89.3 | v111.2,85.1 v111.2,89.7 | v95.4,85.1 95.6,84.9 95.6,75.3 91.6,71.3 89.8,71.3 89.2,70.7 89.2,69.9 90,69.1 92,69.1 92.4,69.5 92.6,69.5 93.6,68.5 93.6,67.1 93.4,66.9 93.4,66.1 93.6,65.9 93.6,64.3 93.4,64.1 93.4,63.3 94.4,62.3 94.4,59.1 94.8,58.7 94.8,47.7 v94.6,47.5
  Bottom 0.254: v77.2,13.5 77,13.7 69.8,13.7 69.6,13.5 63.6,13.5 63.4,13.3 62.6,13.3 62.4,13.5 57.4,13.5 56,12.1 56,10.9 IC12.2 | v84,31.1 v81.8,31.1 | v84.2,35.9 84.4,36.1 85.2,36.1 85.4,36.3 88.8,36.3 89,36.1 v89.2,36.1 | v162.2,106.7 162,106.7 159,103.7 141.2,103.7 141,103.5 133.6,103.5 v133.4,103.7 | v131.8,97.5 v133.4,97.5 | v124.4,89.3 124.2,89.1 119.8,89.1 119.4,89.5 111.4,89.5 v111.2,89.7 | v111.2,85.1 111,84.9 104.6,84.9 104.4,85.1 102.6,85.1 102.4,84.9 95.6,84.9 v95.4,85.1 | v94.6,47.5 95.2,46.9 95.2,43.1 92.4,40.3 92.2,40.3 91.6,39.7 91,39.7 BELLATRIX.17
B13  (via drill 0.3)
  Top 0.254: v63,14.1 61,12.1 61,10.9 IC12.4 | v78,14.3 78,15.9 78.2,16.1 78.2,16.9 78.6,17.3 78.6,18.9 81.4,21.7 81.4,26.1 81.6,26.3 81.6,28.3 82,28.7 82,28.9 82.6,29.5 v82.6,36.7 | v156.4,109.5 160.8,109.5 163.4,112.1 163.4,112.3 U$1.6 | v110,96.3 v110,103.5 | v89.2,93.5 89.2,91.1 89,90.9 89,83.9 88.8,83.7 88.8,81.3 v89,81.1 | v77.8,79.7 75,76.9 75,67.5 v75.2,67.3 | v71.2,67.3 71.2,67.1 71,66.9 71,62.9 70.4,62.3 70.4,60.7 70.6,60.5 70.6,52.1 v70.4,51.9 | v73.8,51.9 73.6,51.7 73.6,45.7 73.8,45.5 v73.8,39.5
  Bottom 0.254: v63,14.1 69.4,14.1 69.6,14.3 v78,14.3 | BELLATRIX.18 90.8,37.3 90,37.3 89.6,36.9 85.2,36.9 85,36.7 v82.6,36.7 82.4,36.7 80.6,38.5 80.4,38.5 80,38.9 78.4,38.9 78,39.3 74,39.3 v73.8,39.5 | v156.4,109.5 156.2,109.7 143.2,109.7 139.4,105.9 132,105.9 130.2,107.7 121.8,107.7 121.2,107.1 117,107.1 116,106.1 115,106.1 114.8,105.9 114,105.9 113.8,106.1 112.8,106.1 112,105.3 111.8,105.3 v110,103.5 | v110,96.3 109.8,96.1 101.8,96.1 101.4,96.5 97.2,96.5 94.2,93.5 92.6,93.5 92.4,93.3 89.4,93.3 v89.2,93.5 | v89,81.1 88.8,81.3 83.4,81.3 82,79.9 81,79.9 80.6,79.5 78.4,79.5 78.2,79.7 v77.8,79.7 | v71.2,67.3 v75.2,67.3 | v73.8,51.9 v70.4,51.9
B14  (via drill 0.3)
  Top 0.254: v69,14.9 66.2,12.1 66.2,10.9 IC12.6 | v78.8,15.5 78.8,16.7 82.6,20.5 82.6,25.7 83.8,26.9 83.8,28.3 84.8,29.3 84.8,34.5 v84.6,34.7 | v154.6,108.9 v154.6,111.1 | v130.8,105.3 130.6,105.1 130.6,104.7 129,103.1 v128.8,103.1 | v121.6,96.3 121.8,96.1 121.8,95.1 120.6,93.9 v120.6,92.9 | v108.4,90.9 108.4,84.7 104.4,80.7 104.4,80.3 v104.2,80.1 | v97.6,79.7 97.4,79.5 97.4,74.3 v97.6,74.1 | v93.2,74.1 92.6,73.5 92.4,73.5 91.8,74.1 90,74.1 v89,75.1 | v82.2,75.1 82.2,71.1 82.4,70.9 82.4,70.1 83,69.5 v83,69.3 | v86.2,68.5 86.2,67.5 86.6,67.1 86.6,61.9 v86.4,61.7 | v93.6,60.1 93.8,59.9 93.8,58.9 94.2,58.5 94.2,50.1 v94,49.9 | v99.2,49.9 99,49.7 99,34.9 v99.2,34.7
  Bottom 0.254: v69,14.9 75.2,14.9 75.4,15.1 78,15.1 78.4,15.5 v78.8,15.5 | v84.6,34.7 90.8,34.7 BELLATRIX.19 91,34.7 v99.2,34.7 | v154.6,111.1 157.4,111.1 157.6,111.3 159,111.3 160.2,112.5 160.8,112.5 U$1.4 | v154.6,108.9 154.4,109.1 143.4,109.1 139.6,105.3 v130.8,105.3 | v128.8,103.1 126.8,103.1 126.6,103.3 125.2,103.3 124.6,102.7 124.6,101.9 123.8,101.1 123.8,98.5 v121.6,96.3 | v120.6,92.9 120.4,93.1 110.6,93.1 v108.4,90.9 | v104.2,80.1 103.8,79.7 v97.6,79.7 | v93.2,74.1 v97.6,74.1 | v89,75.1 88.8,74.9 84.4,74.9 84.2,75.1 v82.2,75.1 | v83,69.3 83.8,69.3 84.4,68.7 86,68.7 v86.2,68.5 | v86.4,61.7 89.8,61.7 90,61.5 92,61.5 92.2,61.7 92.4,61.7 93.6,60.5 v93.6,60.1 | v94,49.9 94.2,49.7 99,49.7 v99.2,49.9
B15  (via drill 0.3)
  Top 0.254: v74.8,15.7 71.2,12.1 71.2,10.9 IC12.8 | v83,17.7 83.2,17.9 83.2,25.5 84.4,26.7 84.4,27.7 v84.6,27.9 | v91.2,27.9 91,28.1 91,32.1 BELLATRIX.20 | v156.6,112.5 156.4,112.5 156.2,112.7 156.2,112.9 155.8,113.3 155,113.3 153.8,112.1 153.8,108.5 155,107.3 155,86.7 v154.6,86.3 | v160.6,85.1 160.6,77.7 163.2,75.1 163.2,64.3 v163,64.1 | v156,63.3 156.2,63.1 156.2,53.7 v155.8,53.3 | v140.2,50.1 140,50.3 139.8,50.3 139,49.5 137.4,49.5 v135.8,47.9 | v133.2,47.9 133.4,47.7 133.4,44.5 133.2,44.3 133.2,43.7 v132.8,43.3 | v122.8,34.5 v122.8,38.7
  Bottom 0.254: v74.8,15.7 77.8,15.7 79.8,17.7 v83,17.7 | v84.6,27.9 86,27.9 86.2,27.7 91,27.7 v91.2,27.9 | v156.6,112.5 158.2,112.5 U$1.2 | v154.6,86.3 154.8,86.5 159.2,86.5 v160.6,85.1 | v163,64.1 162.8,64.1 162.6,64.3 161,64.3 160,63.3 v156,63.3 | v155.8,53.3 153.2,53.3 152.6,52.7 152.4,52.7 151.8,52.1 150,52.1 148,50.1 144.6,50.1 144.4,49.9 142.2,49.9 142,50.1 141.6,50.1 141.4,49.9 140.4,49.9 v140.2,50.1 | v133.2,47.9 v135.8,47.9 | v132.8,43.3 131.8,42.3 130.4,42.3 130,41.9 129.8,41.9 129.4,41.5 128.4,41.5 126.6,39.7 124.8,39.7 124.6,39.9 124,39.9 v122.8,38.7 | v122.8,34.5 122.6,34.7 117,34.7 116.8,34.9 116.4,34.9 115.4,33.9 107.6,33.9 107.2,33.5 105.4,33.5 104.8,32.9 104.6,32.9 104.4,33.1 104,33.1 103.8,32.9 98.8,32.9 98.4,32.5 94.4,32.5 94.2,32.7 93,32.7 92.4,32.1 91,32.1 BELLATRIX.20
BEL-SCL  (via drill 0.3)
  Top 0.254: v56.6,94.1 56.6,98.1 55.2,99.5 RN3.5 | v101.2,72.9 101.2,85.1 100.8,85.5 v100.8,89.1 100.6,89.3 100.6,94.9 v100.8,95.1 | v71.8,86.3 71.2,85.7 68.6,85.7 v65.2,89.1 | v190.8,115.3 190.8,114.5 191,114.3 191,113.7 191.4,113.3 191.4,112.5 U$1.28 | v140.8,111.1 140.8,98.3 v139.2,96.7
  Bottom 0.254: v56.6,94.1 60.4,90.3 61.6,90.3 BEL.6 61.8,90.3 62.6,90.3 63.8,89.1 v65.2,89.1 | v101.2,72.9 101.8,72.3 104.2,72.3 104.6,72.7 106.2,72.7 BELLATRIX.37 | v100.8,89.1 100.6,88.9 87.4,88.9 87.2,89.1 82.6,89.1 79.6,86.1 78.4,86.1 78.2,86.3 76.8,86.3 76.6,86.1 72,86.1 v71.8,86.3 | v190.8,115.3 190.6,115.1 157.2,115.1 155.4,113.3 155,113.3 152.6,110.9 141,110.9 v140.8,111.1 | v139.2,96.7 125.4,96.7 124.6,95.9 124.4,95.9 123.4,94.9 101,94.9 v100.8,95.1
BEL-SDA  (via drill 0.3)
  Top 0.254: v57.4,96.7 v57.4,90.7 | v55.8,96.7 52.6,99.9 52.6,100.7 RN3.4 | v94.2,76.5 94.2,81.3 v94.4,81.5 | v82,81.7 81,82.7 77.4,82.7 77,82.3 76,82.3 v75.8,82.5 | v62,82.9 61.8,83.1 61.8,87.7 BEL.5 | v192.6,101.5 192.6,110.7 193.8,111.9 193.8,112.3 U$1.30 | v157,95.9 156.8,95.7 156.8,85.7 157,85.5 157,82.5 156.4,81.9 156.4,75.3 v156.6,75.1 | v133.4,77.7 v133.4,75.5 | v108,78.5 108,77.5 106.6,76.1 106.6,75.9 106.4,75.7 106.2,75.7 106.2,75.5 BELLATRIX.38
  Bottom 0.254: v57.4,90.7 60.4,87.7 61.6,87.7 BEL.5 | v55.8,96.7 v57.4,96.7 | v94.2,76.5 103.8,76.5 105,75.3 106.2,75.3 BELLATRIX.38 | v94.4,81.5 90.6,81.5 90.2,81.9 82.2,81.9 v82,81.7 | v75.8,82.5 75.6,82.7 74,82.7 73.6,83.1 62.2,83.1 v62,82.9 | v192.6,101.5 192.4,101.7 188.4,101.7 188,101.3 187.2,101.3 187,101.1 177.2,101.1 177,100.9 176.4,100.9 171.6,96.1 157.2,96.1 v157,95.9 | v156.6,75.1 156.4,75.3 153,75.3 152.8,75.1 151.6,75.1 151.2,75.5 v133.4,75.5 | v133.4,77.7 133.2,77.5 109.2,77.5 108.2,78.5 v108,78.5
BLAU  (via drill 0.3)
  Top 0.254: v75.2,96.5 75.2,100.7 73,102.9 73,104.5 72,105.5 72,106.1 X5.3 | v64.2,95.9 64.2,92.5 64,92.3 64,91.3 64.4,90.9 64.4,84.1 60.8,80.5 60.8,70.9 61,70.7 61,67.3 59.4,65.7 59.4,58.1 59.6,57.9 59.6,40.9 59.4,40.7 v59.4,26.3 | v51.4,26.1 51.4,8.1 55,4.5 55.2,4.5 55.2,4.7 R9.1
  Bottom 0.254: R10.1 60,4.7 55.2,4.7 R9.1 | v75.2,96.5 75,96.7 65,96.7 v64.2,95.9 | v59.4,26.3 59.2,26.1 v51.4,26.1
BUSCLK  (via drill 0.3)
  Top 0.254: v177.6,66.1 176,67.7 176,70.1 176.4,70.5 176.4,87.1 | 176.4,87.1 176.4,96.1 177.8,97.5 177.8,105.1 v177.6,105.3 | v109.6,66.3 109.4,66.5 109.4,81.7 109.6,81.9 v109.6,87.3 | 176.4,87.1 v176.2,87.1
  Bottom 0.254: REGNATIX.34 79.6,65.3 80.6,65.3 81.8,64.1 92,64.1 92.4,64.5 93.2,64.5 93.4,64.3 93.6,64.3 93.8,64.5 103.4,64.5 104,65.1 106.2,65.1 BELLATRIX.34 106.4,65.1 107.4,65.1 108.6,66.3 v109.6,66.3 | v177.6,66.1 180.2,66.1 ADMINISTRA.34 | v177.6,105.3 179.6,105.3 180.8,106.5 180.8,107.3 181,107.3 U$1.19 | v109.6,87.3 109.8,87.1 118.6,87.1 119,86.7 148.6,86.7 149,87.1 v176.2,87.1
CLK
  Top 0.254: TASTATUR.3 115.2,98.3 115.2,101.3 114.4,102.1 114.4,102.9 113.6,103.7 113.6,104.3 113.4,104.5 113.4,104.9 R18.1 113.4,105.1 113.4,108.9 KEY.6
  Bottom 0.254: R18.1 113.4,105.1 114,105.1 114.2,105.3 114.8,105.3 115,105.1 115.6,105.1 R14.1
D0  (via drill 0.3)
  Top 0.254: v165,83.3 165,99.9 158.4,106.5 158.4,107.3 U$1.1 | IC4.3 130.8,48.5 130.8,48.7 132,48.7 133.2,49.9 v133.2,50.1 133.4,50.3 133.4,53.7 130.8,56.3 130.8,61.5 129.4,62.9 129.4,63.9 129.2,64.1 129.2,66.1 129.4,66.3 129.4,66.7 129.2,66.9 129.2,67.1 129,67.3 v129,69.1 | IC9.13 44.8,47.3 44.8,48.3 45,48.5 44.8,48.7 44.8,59.7 45.2,60.1 45.2,60.9 45.8,61.5 45.8,64.7 44.8,65.7 44.8,66.7 IC10.13 44.8,66.9 44.8,67.9 45.4,68.5 45.4,68.7 46.4,69.7 46.4,70.1 46.6,70.3 46.6,78.7 v46.4,78.9 | v91,83.1 91,80.5 BELLATRIX.1 | v124.4,69.1 124.6,69.3 124.6,77.7 123.2,79.1 123.2,79.3 122.8,79.7 122.8,80.3 IC8.13
  Bottom 0.254: ADMINISTRA.1 165,81.5 v165,83.3 164.8,83.5 163.4,83.5 162.8,82.9 162,82.9 161.8,83.1 120.8,83.1 | IC4.3 130.6,48.5 128.8,48.5 128.2,47.9 127.2,47.9 126.6,47.3 124.8,47.3 124.4,47.7 124,47.7 123.8,47.5 120,47.5 119,48.5 118.2,48.5 IC7.3 | v133.2,50.1 137.2,50.1 137.4,49.9 137.6,49.9 138,49.5 139.4,49.5 139.6,49.3 141,49.3 141.8,48.5 143.2,48.5 IC5.3 | 120.8,83.1 122.4,81.5 122.6,81.5 122.6,80.5 IC8.13 | 120.8,83.1 v91,83.1 78.6,83.1 76,80.5 65.8,80.5 65.6,80.3 65.4,80.5 64.4,80.5 REGNATIX.1 64.2,80.5 63.2,80.5 61.4,78.7 48.6,78.7 48.4,78.9 v46.4,78.9 | v129,69.1 128.8,68.9 124.6,68.9 v124.4,69.1
D1  (via drill 0.3)
  Top 0.254: IC9.14 47.2,47.3 47.2,59.7 47.8,60.3 47.8,60.9 48.4,61.5 48.4,63.3 47.8,63.9 47.8,64.9 47.2,65.5 47.2,66.7 IC10.14 47.2,66.9 47.2,67.7 47.6,68.1 47.6,68.5 48,68.9 48,70.1 47.8,70.3 47.8,77.9 v48,78.1 | v161.6,80.1 161.8,80.3 161.8,83.1 161.6,83.3 161.6,84.1 161.8,84.3 161.8,84.5 | 161.8,84.5 161.8,100.7 161.4,101.1 v161.4,102.3 | v161.4,104.7 161.4,106.7 161,107.1 160.8,107.1 160.8,107.3 U$1.3 | v127.6,44.1 128.2,44.7 128.6,44.7 129.6,45.7 130.8,45.7 IC4.4 | 117.6,84.3 117.2,84.7 116.2,84.7 v113.8,82.3 | 117.6,84.3 120.2,81.7 120.2,80.5 IC8.14 | v110,46.9 110.2,47.1 110.2,51.9 109,53.1 109,61.3 108.4,61.9 108.4,62.7 108.8,63.1 v108.8,82.3 | v161.6,84.5 161.8,84.5 | 117.6,84.3 v117.6,84.5 | v67,81.3 v67,79.7 | v83.4,83.9 83.6,83.7 83.6,83.5 84,83.1 84,78.1 v83.8,77.9
  Bottom 0.254: v48,78.1 64.2,78.1 REGNATIX.2 64.4,78.1 65.4,78.1 v67,79.7 | v161.6,80.1 162.8,80.1 164,78.9 165,78.9 ADMINISTRA.2 | v161.4,104.7 v161.4,102.3 | IC5.4 143.2,45.9 142,45.9 141,46.9 139.6,46.9 139.4,47.1 137.4,47.1 137,46.7 136.8,46.7 136.6,46.9 136.4,46.9 136.2,47.1 133,47.1 131.8,45.9 IC4.4 | v127.6,44.1 127,44.1 126.2,44.9 120.4,44.9 119.4,45.9 118.2,45.9 IC7.4 118,45.9 116.8,45.9 115.8,46.9 v110,46.9 | v113.8,82.3 113.6,82.5 108.8,82.5 | 108.8,82.5 96.6,82.5 92,77.9 91,77.9 BELLATRIX.2 90.8,77.9 v83.8,77.9 | 108.8,82.5 v108.8,82.3 | v161.6,84.5 161.4,84.3 117.8,84.3 v117.6,84.5 | v67,81.3 67.2,81.1 75.8,81.1 78.4,83.7 83.2,83.7 v83.4,83.9
D2  (via drill 0.3)
  Top 0.254: IC9.15 49.8,47.3 49.8,48.5 49.6,48.7 49.6,48.9 49.8,49.1 49.8,59.7 50.2,60.1 50.2,60.7 50.8,61.3 50.8,63.5 50.6,63.7 50.6,64.1 50.8,64.3 50.8,64.7 49.8,65.7 49.8,66.7 IC10.15 49.8,66.9 49.8,68.1 50.4,68.7 50.4,69.9 50.6,70.1 50.6,70.9 50.4,71.1 50.4,73.5 v50.6,73.7 | v162.4,101.3 v162.4,83.7 162.4,78.1 164.2,76.3 165,76.3 ADMINISTRA.3 | v163.6,102.5 163.6,106.5 163.4,106.7 163.4,107.3 U$1.5 | v116.6,83.9 116.6,82.7 117.6,81.7 117.6,80.5 IC8.15 117.6,80.3 117.6,79.1 117.2,78.7 117.2,66.9 116.6,66.3 116.6,64.5 115.6,63.5 115.6,39.5 116.8,38.3 118,38.3 IC7.7 | v93.6,83.9 v93.6,82.3 93.6,77.1 92.4,75.9 92.2,75.9 92,75.7 91,75.7 91,75.5 BELLATRIX.3
  Bottom 0.254: v50.6,73.7 52.8,73.7 53,73.5 61,73.5 63,75.5 64.2,75.5 REGNATIX.3 64.4,75.5 65.2,75.5 66.2,76.5 66.4,76.5 69.8,79.9 76.2,79.9 78.8,82.5 90.4,82.5 90.6,82.3 91.4,82.3 91.6,82.5 93.4,82.5 v93.6,82.3 | v163.6,102.5 v162.4,101.3 | IC7.7 118.2,38.3 119.4,38.3 120.4,37.3 123.8,37.3 124,37.5 124.4,37.5 124.8,37.1 126.6,37.1 127,37.5 128,37.5 128.8,38.3 130.6,38.3 IC4.7 131.8,38.3 133,37.1 136.2,37.1 136.4,37.3 136.6,37.3 136.8,37.5 137,37.5 137.4,37.1 139.4,37.1 139.6,37.3 141,37.3 142,38.3 143.2,38.3 IC5.7 | 116.4,83.7 93.8,83.7 v93.6,83.9 | 116.4,83.7 v162.4,83.7 | 116.4,83.7 v116.6,83.9
D3  (via drill 0.3)
  Top 0.254: IC10.17 52.4,81.9 52.4,79.9 52.6,79.7 52.6,79.5 52.4,79.3 v52.4,72.9 52.4,69.9 54.2,68.1 54.2,63.5 52.6,61.9 52.4,61.9 52.4,62.3 IC9.17 | v168.6,74.3 168.4,74.5 168.4,100.3 v168.6,100.5 | v167,102.1 167,105.5 166,106.5 166,107.3 U$1.7 | v128.4,34.1 128.4,34.3 129.6,35.5 130.8,35.5 | 130.8,35.5 130.8,35.7 IC4.8 130.8,35.5 | IC7.8 118,35.9 117,35.9 115,37.9 115,65.1 IC8.17 115,65.3 115,65.7 115.6,66.3 115.6,66.5 116.4,67.3 v116.4,68.5 | v133.2,34.1 133.2,34.3 132,35.5 130.8,35.5
  Bottom 0.254: v52.4,72.9 64.2,72.9 REGNATIX.4 64.4,72.9 65.4,72.9 65.8,72.5 77.8,72.5 78.4,71.9 80.6,71.9 81,72.3 86.2,72.3 86.4,72.1 88.2,72.1 88.8,72.7 90.8,72.7 BELLATRIX.4 91,72.7 92.4,72.7 95.6,69.5 104.8,69.5 105.2,69.1 107.2,69.1 107.4,69.3 108,69.3 109,68.3 116.6,68.3 | v168.6,74.3 167.6,74.3 167,73.7 165.2,73.7 ADMINISTRA.4 165,73.7 163.6,73.7 159.6,69.7 159.6,69.1 158.8,68.3 116.6,68.3 | v167,102.1 v168.6,100.5 | v128.4,34.1 128.2,34.3 127.6,34.3 127.4,34.1 127,34.1 126.4,34.7 124.6,34.7 124.2,35.1 123.8,35.1 123.6,35.3 120.2,35.3 119.8,35.7 118.2,35.7 IC7.8 | v133.2,34.1 137.2,34.1 137.4,34.3 137.6,34.3 138,34.7 139.4,34.7 139.6,34.9 141,34.9 141.8,35.7 143.2,35.7 IC5.8 | 116.6,68.3 v116.4,68.5
D4  (via drill 0.3)
  Top 0.254: IC10.18 49.8,81.9 v49.8,70.5 49.8,68.9 48.6,67.7 48.6,65.9 49,65.5 49,64.5 49.8,63.7 49.8,62.5 IC9.18 | v81.2,71.3 80.8,71.3 80.6,71.5 78.4,71.5 78,71.1 v77.4,71.7 | v169.2,73.5 169.2,73.7 169.4,73.9 169.4,74.7 169,75.1 169,99.7 169.4,100.1 v169.4,101.3 | v168.2,102.5 168.2,106.5 168.4,106.7 168.4,107.3 U$1.9 | v120.8,36.5 120.8,53.9 119,55.7 119,62.5 117.6,63.9 117.6,65.1 IC8.18 117.6,65.3 117.6,66.5 117.8,66.7 117.8,71.3 v118,71.5 | v160.4,67.9 160.4,61.9 160,61.5 160,50.5 160.4,50.1 160.4,49.3 159.4,48.3 159.4,36.9 v159.6,36.7 | v94.6,71.7 v93.4,70.5
  Bottom 0.254: v49.8,70.5 64.2,70.5 REGNATIX.5 64.4,70.5 65.4,70.5 66.8,71.9 77.2,71.9 v77.4,71.7 | v81.2,71.3 81.4,71.3 81.8,71.7 86,71.7 86.2,71.5 88.8,71.5 90,70.3 90.8,70.3 BELLATRIX.5 91,70.3 93.2,70.3 v93.4,70.5 | v169.2,73.5 168.4,73.5 166.2,71.3 165.2,71.3 ADMINISTRA.5 165,71.3 163.8,71.3 v160.4,67.9 | v168.2,102.5 v169.4,101.3 | v120.8,36.5 121,36.7 123.8,36.7 124.8,35.7 125.6,35.7 IC7.13 125.8,35.7 126.6,35.7 127.4,34.9 129.4,34.9 129.6,34.7 131.8,34.7 132,34.9 136.2,34.9 137,35.7 138.4,35.7 IC4.13 138.6,35.7 139.6,35.7 140.6,36.7 141.4,36.7 141.6,36.5 142,36.5 142.4,36.9 144.2,36.9 145.4,35.7 150.8,35.7 IC5.13 151,35.7 151.8,35.7 152.8,36.7 v159.6,36.7 | v94.6,71.7 108.2,71.7 108.4,71.5 v118,71.5
D5  (via drill 0.3)
  Top 0.254: IC10.19 47.2,81.9 v47.2,69.7 47.2,69.5 46.6,68.9 46.6,68.3 46.2,67.9 46.2,65.7 46.6,65.3 46.6,64.3 47.2,63.7 47.2,62.5 IC9.19 | 119.6,61.9 119.6,55.9 121.4,54.1 121.4,41.3 124.4,38.3 125.6,38.3 IC7.14 | 119.6,61.9 119.6,62.7 120.2,63.3 120.2,65.1 IC8.19 | v161.2,67.3 161,67.1 161,61.7 160.6,61.3 160.6,50.7 161,50.3 161,49.1 160,48.1 160,39.5 v160.2,39.3 | v170,104.3 170,105.5 170.6,106.1 170.6,106.3 171,106.7 171,107.3 U$1.11 | v170.2,102.1 170.2,100.9 170,100.7 170,99.9 169.6,99.5 169.6,75.3 170,74.9 170,71.1 v168.6,69.7 | v94.2,63.7 v94.2,66.5 | 119.6,61.9 v119.8,61.9
  Bottom 0.254: v47.2,69.7 50.2,69.7 50.4,69.9 61,69.9 63,67.9 64.2,67.9 REGNATIX.6 64.4,67.9 65.4,67.9 66.4,68.9 77.6,68.9 77.8,68.7 78.2,68.7 78.6,69.1 80.6,69.1 83.2,66.5 88.2,66.5 88.8,67.1 89,67.1 89.6,67.7 90.8,67.7 BELLATRIX.6 91,67.7 92.4,67.7 93,67.1 93.2,67.1 93.8,66.5 v94.2,66.5 | IC7.14 125.8,38.3 127,38.3 128.2,39.5 128.8,39.5 129.2,39.1 129.4,39.1 129.6,39.3 132.6,39.3 132.8,39.5 136.2,39.5 137.4,38.3 IC4.14 138.6,38.3 139.4,38.3 140.4,39.3 141.4,39.3 141.6,39.1 142,39.1 142.2,39.3 144.4,39.3 145,38.7 145.8,38.7 146.2,38.3 150.8,38.3 IC5.14 151,38.3 152.2,38.3 153.2,39.3 v160.2,39.3 | v161.2,67.3 162.6,67.3 164,68.7 165,68.7 ADMINISTRA.6 165.2,68.7 166.4,68.7 167.4,69.7 v168.6,69.7 | v170,104.3 170,102.3 v170.2,102.1 | v94.2,63.7 94.4,63.9 104,63.9 104.2,64.1 108.2,64.1 108.4,63.9 108.6,63.9 109.2,63.3 109.4,63.3 109.8,62.9 110.6,62.9 111.6,61.9 v119.8,61.9
D6  (via drill 0.3)
  Top 0.254: IC10.20 44.8,81.9 44.8,79.9 45,79.7 45,79.5 44.8,79.3 v44.8,71.3 44.8,68.9 43.6,67.7 43.6,65.7 43.8,65.5 43.8,64.5 44.4,63.9 44.4,63.7 44.8,63.3 44.8,62.5 IC9.20 | v61.6,71.3 v61.6,66.7 | v157.2,64.9 157.4,64.7 157.4,51.1 152.2,45.9 151,45.9 IC5.17 | U$1.13 173.6,107.3 173.6,106.7 167.8,100.9 167.8,67.9 166.2,66.3 165.2,66.3 ADMINISTRA.7 | IC8.20 122.8,65.1 122.8,64.1 123.2,63.7 123.2,63.5 125.2,61.5 125.2,56.7 123,54.5 123,47.3 124.4,45.9 125.6,45.9 IC7.17 | v74.6,65.5 76.6,65.5 v76.8,65.3
  Bottom 0.254: v61.6,66.7 63,65.3 64.2,65.3 REGNATIX.7 64.4,65.3 66.6,65.3 66.8,65.5 67,65.5 67.2,65.3 74.4,65.3 v74.6,65.5 | v61.6,71.3 61.4,71.1 50.4,71.1 50.2,71.3 v44.8,71.3 | IC8.20 122.6,65.3 122.6,66.1 121,67.7 109,67.7 108.4,67.1 107.8,67.1 107.2,66.5 106.6,66.5 106.4,66.3 105.2,66.3 104.6,65.7 103.8,65.7 103.2,65.1 91,65.1 BELLATRIX.7 90.8,65.1 90,65.1 89.8,65.3 82.4,65.3 81.8,65.9 81.2,65.9 80.6,66.5 78.6,66.5 77.4,65.3 v76.8,65.3 | IC7.17 125.8,45.9 127,45.9 128.2,44.7 128.8,44.7 129.2,45.1 129.4,45.1 129.6,44.9 132.6,44.9 132.8,44.7 136.2,44.7 137.4,45.9 IC4.17 138.6,45.9 139.4,45.9 140.4,44.9 141.4,44.9 141.6,45.1 142,45.1 142.2,44.9 144.4,44.9 145,45.5 145.8,45.5 146.2,45.9 150.8,45.9 IC5.17 | v157.2,64.9 162.8,64.9 164,66.1 165,66.1 ADMINISTRA.7
D7  (via drill 0.3)
  Top 0.254: IC10.21 42.2,81.9 42.2,68.9 41,67.7 41,65.9 41.4,65.5 41.4,65.1 41.2,64.9 41.2,64.3 42.2,63.3 42.2,62.5 IC9.21 | v128.2,49.3 128.2,51.5 128.4,51.7 128.4,56.6 127,58.1 v127,62.5 125.2,65.1 IC8.21 | v159.6,62.3 159.4,62.1 159.4,49.9 v159.6,49.7 | U$1.15 176.2,107.3 176.2,106.7 170.8,101.3 170.8,100.7 170.6,100.5 170.6,99.7 170.2,99.3 170.2,75.5 170.6,75.1 170.6,70.9 169.4,69.7 169.4,69.3 168.4,68.3 168.4,67.7 167.8,67.1 167.8,65.3 166.2,63.7 165.2,63.7 ADMINISTRA.8 | v103.6,60.3 103.6,56.9 v103.8,56.7 | v116.4,56.9 116.2,57.1 116.2,62.5 v116.4,62.7
  Bottom 0.254: IC9.21 42.2,62.5 42.4,62.5 42.4,61.3 43.8,59.9 60.2,59.9 62.6,62.3 62.8,62.3 63.4,62.9 64.2,62.9 REGNATIX.8 64.4,62.9 65.4,62.9 66.6,64.1 77.4,64.1 77.6,63.9 80.6,63.9 81,63.5 88.8,63.5 89.6,62.7 90.8,62.7 BELLATRIX.8 91,62.7 92.2,62.7 94.6,60.3 v103.6,60.3 | IC7.18 125.8,48.5 126.6,48.5 127.4,49.3 v128.2,49.3 129.4,49.3 129.6,49.5 131.8,49.5 132,49.3 136.2,49.3 137,48.5 138.4,48.5 IC4.18 138.6,48.5 139.6,48.5 140.6,47.5 141.4,47.5 141.6,47.7 142,47.7 142.4,47.3 144.2,47.3 145.4,48.5 150.8,48.5 IC5.18 151,48.5 151.8,48.5 153,49.7 v159.6,49.7 | v159.6,62.3 162.8,62.3 164.2,63.7 165,63.7 ADMINISTRA.8 | v103.8,56.7 104.8,56.7 105,56.5 108.4,56.5 108.8,56.9 v116.4,56.9 | v116.4,62.7 116.6,62.5 119.2,62.5 119.4,62.7 120.2,62.7 120.4,62.5 v127,62.5
DAT
  Top 0.254: 117.6,105.1 119.6,105.1 R19.1 119.6,104.7 119.8,104.7 120,104.5 120,103.7 120.6,103.1 120.6,102.1 120,101.5 119.8,101.5 117.8,99.5 117.8,98.3 TASTATUR.2 | KEY.1 115.4,110.7 115.8,110.3 115.8,110.1 116.6,109.3 116.6,106.9 117.4,106.1 117.4,105.9 117.6,105.7 117.6,105.1 | 117.6,105.1 R15.1
GLOB_RESET  (via drill 0.3)
  Top 0.254: 177.6,89.5 177.6,95.7 188.4,106.5 188.4,106.7 188.8,107.1 188.8,107.3 U$1.25 | 177.6,89.5 v177.6,67.3 | v75.8,59.1 76,59.1 v77.6,57.5 | v65.4,105.1 65.4,100.9 RN3.9 | v19.8,109.7 19.8,111.1 18.4,112.5 18.4,113.3 PROPPLUG.3 | v73.8,98.9 v73.8,58.5 | v177.8,89.5 177.6,89.5 | v146.2,88.1 v146.2,91.1 | v81.8,89.7 82,89.9 82,98.5 v81.4,99.1